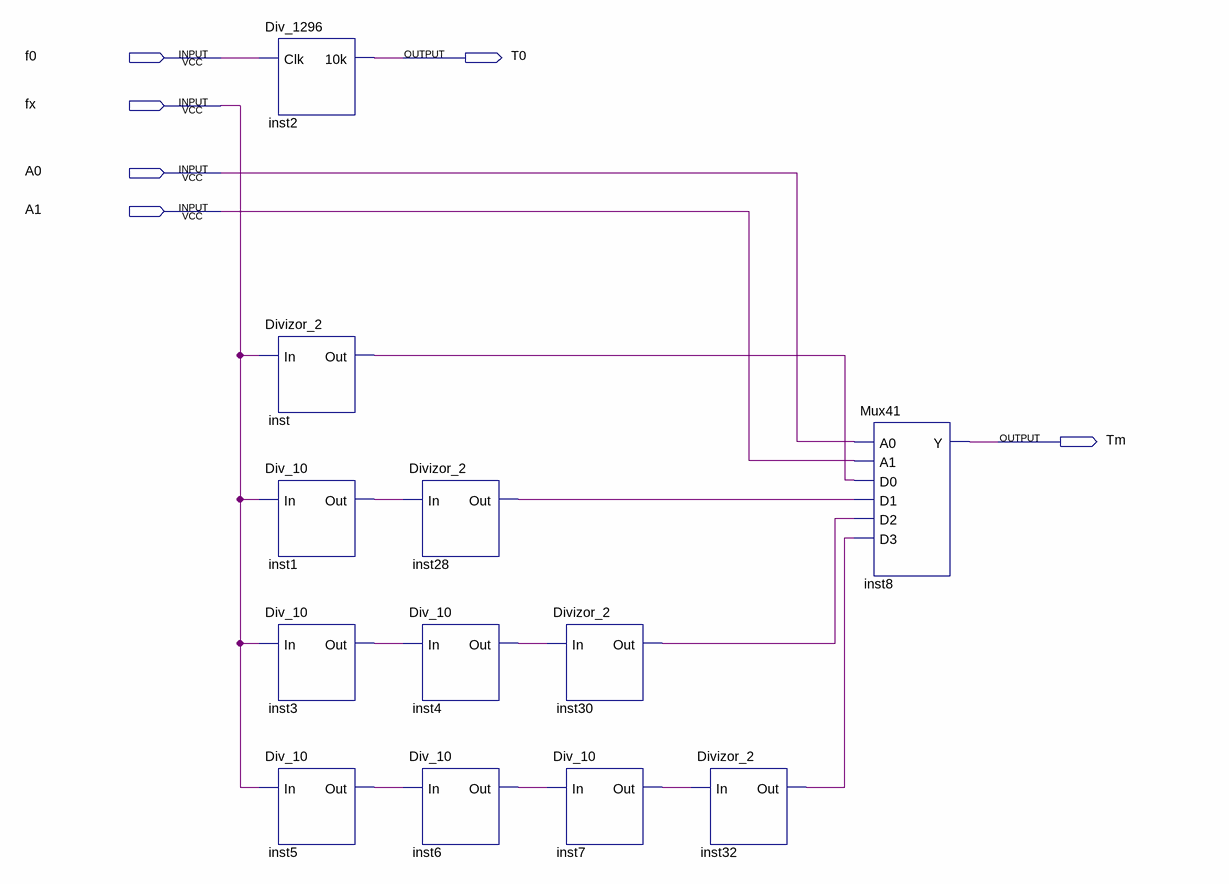
[diagram p0: schematic sheet]
// Quartus schematic Bloc_Divizare.bdf as structural Verilog: 12 symbols, 6 pins
module Bloc_Divizare (
  input  f0,
  input  fx,
  input  A0,
  input  A1,
  output T0,
  output Tm
);

  wire inst1_out, inst3_out, inst4_out, inst5_out, inst6_out, inst7_out, inst28_out, inst30_out, inst32_out,
       inst_out;

  Div_1296 inst2 (.Clk(f0), .\10k (T0));
  Divizor_2 inst (.In(fx), .Out(inst_out));
  Div_10 inst1 (.In(fx), .Out(inst1_out));
  Div_10 inst3 (.In(fx), .Out(inst3_out));
  Div_10 inst5 (.In(fx), .Out(inst5_out));
  Divizor_2 inst28 (.In(inst1_out), .Out(inst28_out));
  Div_10 inst4 (.In(inst3_out), .Out(inst4_out));
  Div_10 inst6 (.In(inst5_out), .Out(inst6_out));
  Divizor_2 inst30 (.In(inst4_out), .Out(inst30_out));
  Div_10 inst7 (.In(inst6_out), .Out(inst7_out));
  Divizor_2 inst32 (.In(inst7_out), .Out(inst32_out));
  Mux41 inst8 (.A0(A0), .A1(A1), .D0(inst_out), .D1(inst28_out), .D2(inst30_out), .D3(inst32_out), .Y(Tm));
endmodule
